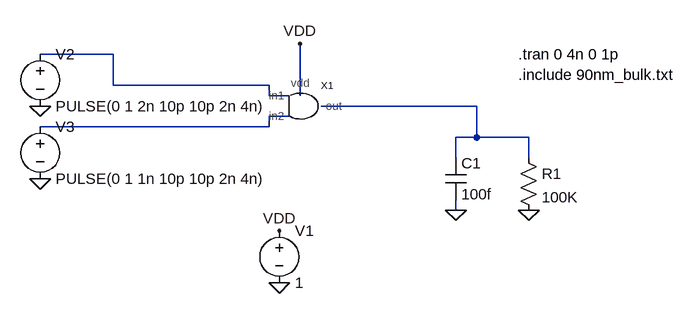
[diagram p0: schematic and-test.asc]
and-test.asc, the LTspice schematic file:
Version 4
SHEET 1 880 680
WIRE -80 64 -192 64
WIRE -80 112 -80 64
WIRE 160 112 -80 112
WIRE 160 128 160 112
WIRE 192 128 160 128
WIRE 208 128 208 48
WIRE 480 144 240 144
WIRE 192 160 160 160
WIRE 160 176 160 160
WIRE 160 176 -192 176
WIRE 480 192 480 144
WIRE 480 192 448 192
WIRE 560 192 480 192
WIRE 448 224 448 192
WIRE 560 224 560 192
WIRE 448 304 448 288
FLAG 208 48 VDD
FLAG 176 336 VDD
FLAG 176 416 0
FLAG 448 304 0
FLAG 560 304 0
FLAG -192 144 0
FLAG -192 256 0
SYMBOL voltage 176 320 R0
WINDOW 123 0 0 Left 2
WINDOW 39 0 0 Left 2
SYMATTR InstName V1
SYMATTR Value 1
SYMBOL voltage -192 48 R0
WINDOW 123 0 0 Left 2
WINDOW 39 0 0 Left 2
SYMATTR InstName V2
SYMATTR Value PULSE(0 1 2n 10p 10p 2n 4n)
SYMBOL res 544 208 R0
SYMATTR InstName R1
SYMATTR Value 100K
SYMBOL cap 432 224 R0
SYMATTR InstName C1
SYMATTR Value 100f
SYMBOL voltage -192 160 R0
WINDOW 123 0 0 Left 2
WINDOW 39 0 0 Left 2
SYMATTR InstName V3
SYMATTR Value PULSE(0 1 1n 10p 10p 2n 4n)
SYMBOL and 208 144 R0
SYMATTR InstName X1
TEXT 544 64 Left 2 !.tran 0 4n 0 1p
TEXT 544 96 Left 2 !.include 90nm_bulk.txt

The netlist it stands for:
* and-test.asc
V1 VDD 0 1
V2 N001 0 PULSE(0 1 2n 10p 10p 2n 4n)
R1 N002 0 100K
C1 N002 0 100f
V3 N003 0 PULSE(0 1 1n 10p 10p 2n 4n)
XX1 N001 N003 VDD N002 and  ; pins in1 in2 vdd out
.tran 0 4n 0 1p
.include 90nm_bulk.txt
.backanno
.end